# EAGLE design wall (EAGLE 5.10)
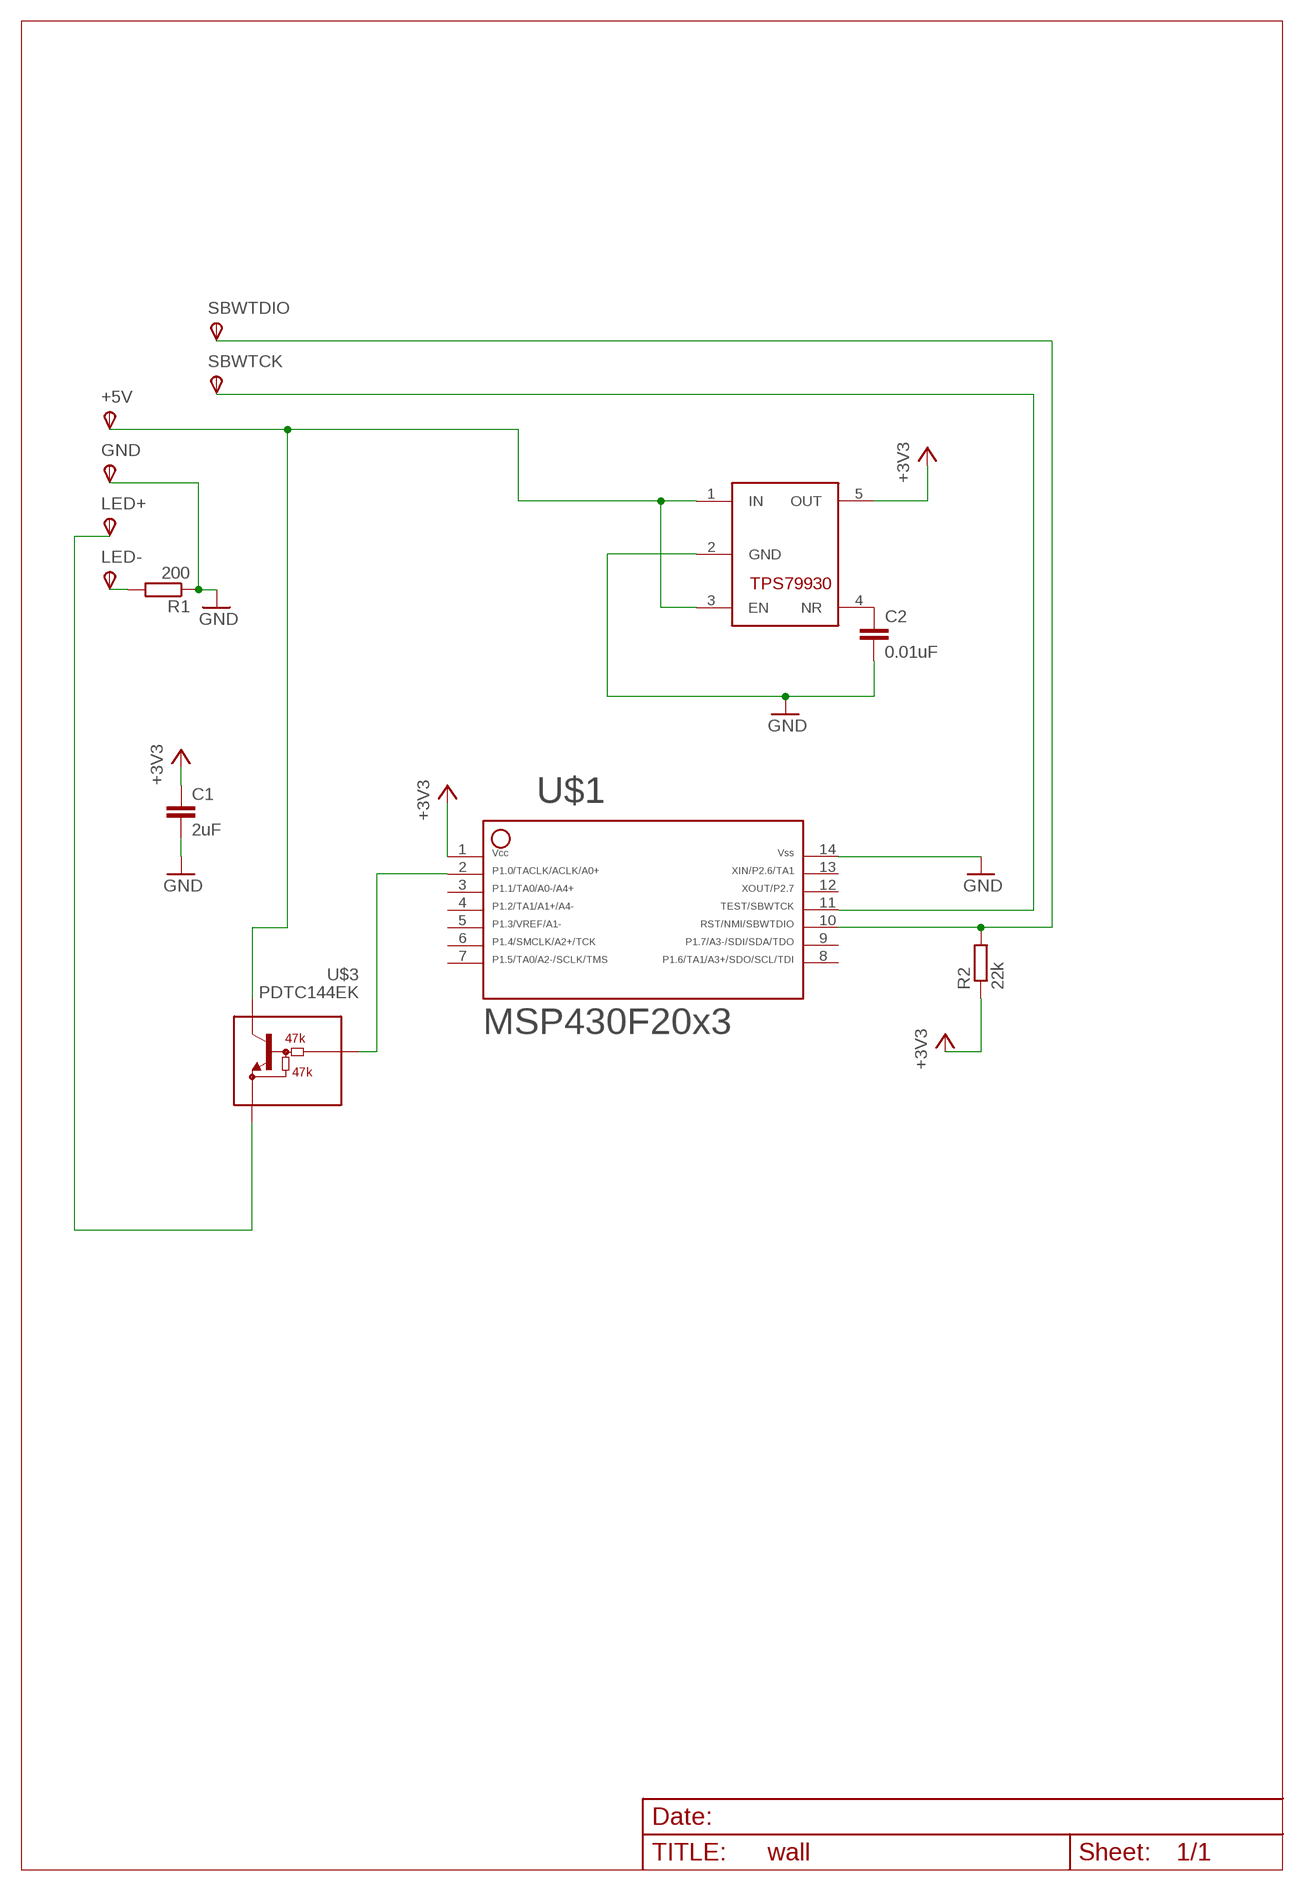
[diagram p0: schematic, sheet 1]

## Parts
+5V  TPSPAD1-13  [P1-13]
C1  2uF  C-EUC0805  [C0805]
C2  0.01uF  C-EUC0805  [C0805]
GND  TPSPAD1-13  [P1-13]
LED+  TPSPAD1-13  [P1-13]
LED-  TPSPAD1-13  [P1-13]
R1  200  R-EU_M0805  [M0805]
R2  22k  R-EU_M0805  [M0805]
SBWTCK  TPSPAD1-13  [P1-13]
SBWTDIO  TPSPAD1-13  [P1-13]
U$1  F20X3---PW14  [PW14]
U$2  TPS79930  [SOT23-5]
U$3  PDTC144EK  [SOT346]

## Nets
+3V3: C1.1 R2.1 U$1.1 U$2.5(OUT)
A2: U$1.2 U$3.B
A10: R2.2 SBWTDIO.TP(PP) U$1.10
GND: C1.2 C2.2 GND.TP(PP) R1.1 U$1.14 U$2.2(GND)
N$1: SBWTCK.TP(PP) U$1.11
N$2: C2.1 U$2.4(NR)
N$3: LED-.TP(PP) R1.2
N$5: LED+.TP(PP) U$3.E
N$6: +5V.TP(PP) U$2.1(IN) U$2.3(EN) U$3.C
Unconnected: U$1.3 U$1.4 U$1.5 U$1.6 U$1.7 U$1.8 U$1.9 U$1.12 U$1.13

## Library data of the parts
+5V GND LED+ LED- SBWTCK SBWTDIO = testpad:TPS: TEST PIN
C1 C2 = rcl:C-EU: CAPACITOR, European symbol
R1 R2 = rcl:R-EU_: RESISTOR, European symbol
U$1 = TI_MSP430_v15:F20X3---PW14: ***MSP430F20x3***PW14
U$2 = egna:TPS79930
U$3 = mina_komponenter:PDTC144EK: Philips 50V, 100mA, 250mW Internal resistors 47k

## Board
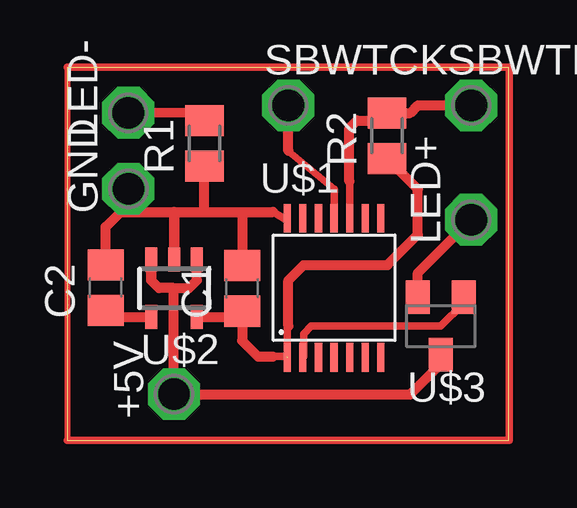
[diagram p1: board, top side]

Size 18.4 x 15.55 mm. Coordinates in mm from the lower left corner, seen from the top.
Outline: 0,0 18.4,0 18.4,15.55 0,15.55 0,0
Copper layers (1*16): Top 0.035mm / dielectric 1.5mm / Bottom 0.035mm
Design rules "default": minimum track width 10mil, minimum drill 24mil, track to track 8mil, track to pad 8mil, pad to pad 8mil, via to via 8mil, smd to smd 8mil, copper to edge 40mil, drill to drill 8mil, minimum pad ring 10mil, minimum via ring 8mil, stop-mask expansion 4mil, vias tented up to drill 0mil, thermal gap 10mil

### Footprints (pad centres in the part's own frame; a part is rotated, then mirrored left to right if it is on the bottom)
P1-13 = drill 1.321 pad 2.159 octagon: TP 0,0
C0805 = smd 1.3 x 1.5: 1 -0.95,0; 2 0.95,0
M0805 = smd 1.3 x 1.6: 1 -0.95,0; 2 0.95,0
PW14 = smd 0.3 x 1.2: 1 -1.95,-2.9; 2 -1.3,-2.9; 3 -0.65,-2.9; 4 0,-2.9; 5 0.65,-2.9; 6 1.3,-2.9; 7 1.95,-2.9; 8 1.95,2.9; 9 1.3,2.9; 10 0.65,2.9; 11 0,2.9; 12 -0.65,2.9; 13 -1.3,2.9; 14 -1.95,2.9
SOT23-5 = smd 0.5 x 1: 1 -0.95,-1.2; 2 0,-1.2; 3 0.95,-1.2; 4 0.95,1.2; 5 -0.95,1.2
SOT346 = smd 1 x 1.4: B -0.95,-1.2; C 0,1.2; E 0.95,-1.2

### Placement (x,y rotation side)
+5V  4.45,1.92 90 top
C1  7.28,6.33 90 top
C2  1.6,6.36 90 top
GND  2.55,10.49 90 top
LED+  16.83,9.2 90 top
LED-  2.54,13.66 90 top
R1  5.71,12.38 90 top
R2  13.33,12.7 90 top
SBWTCK  9.21,13.97 0 top
SBWTDIO  16.83,13.97 0 top
U$1  11.11,6.36 0 top
U$2  4.45,6.34 180 top
U$3  15.56,4.76 180 top

### Tracks (layer width: path | path; a pad name or v marks a point on that pad's centre or on a via)
+3V3  (1 unrouted)
  Top 0.305: 8.57,3.49 9.13,3.49 | U$1.1 9.16,4.72 9.21,4.76
  Top 0.406: U$2.5 7.03,5.13 C1.1 7.28,4.15 7.94,3.49 8.57,3.49 | 9.21,4.76 9.21,6.67 9.84,7.3 13.33,7.3 14.6,8.57 14.6,10.48 R2.1
A2
  Top 0.305: U$3.B 16.51,5.71 15.56,4.76 10.16,4.76 9.84,4.45 9.84,3.49 U$1.2
A10
  Top 0.305: U$1.10 11.76,10.78 11.75,10.79
  Top 0.406: 11.75,10.79 11.75,13.02 12.06,13.34 13.01,13.34 R2.2 14.28,13.65 14.6,13.97 SBWTDIO.TP
GND
  Top 0.305: 8.57,9.53 9.11,9.21 U$1.14
  Top 0.406: 5.72,9.53 8.57,9.53 | C1.2 7.28,9.51 5.72,9.53 | 4.44,9.53 U$2.2 4.45,9.2 4.44,9.53 | 4.44,9.53 5.72,9.53 | 5.72,9.53 R1.1 | C2.2 1.6,8.9 2.22,9.53 2.54,9.53 | 2.54,9.53 4.44,9.53 | GND.TP 2.55,9.53 2.54,9.53
N$1
  Top 0.305: U$1.11 11.11,10.47 9.21,12.07
  Top 0.406: 9.21,12.07 SBWTCK.TP
N$2
  Top 0.406: U$2.4 1.56,5.13 C2.1
N$3
  Top 0.406: R1.2 5.71,13.65 LED-.TP
N$5
  Top 0.406: U$3.E 14.61,6.98 LED+.TP
N$6
  Top 0.406: 3.5,6.66 U$2.3 3.5,6.68 3.49,6.67 3.5,6.66 | 3.5,6.66 3.81,6.35 4.44,6.35 | 4.44,6.35 +5V.TP 4.46,1.9 14.29,1.9 15.56,3.18 U$3.C | 4.44,6.35 5.08,6.35 5.4,6.67 U$2.1
N$7
  Top 0.254: 0,15.56 0,0
  Top 0.305: 0,0 18.42,0 18.42,15.56 0,15.56